# Altium schematic sheet pqm_v2_page3.SchDoc
size A4
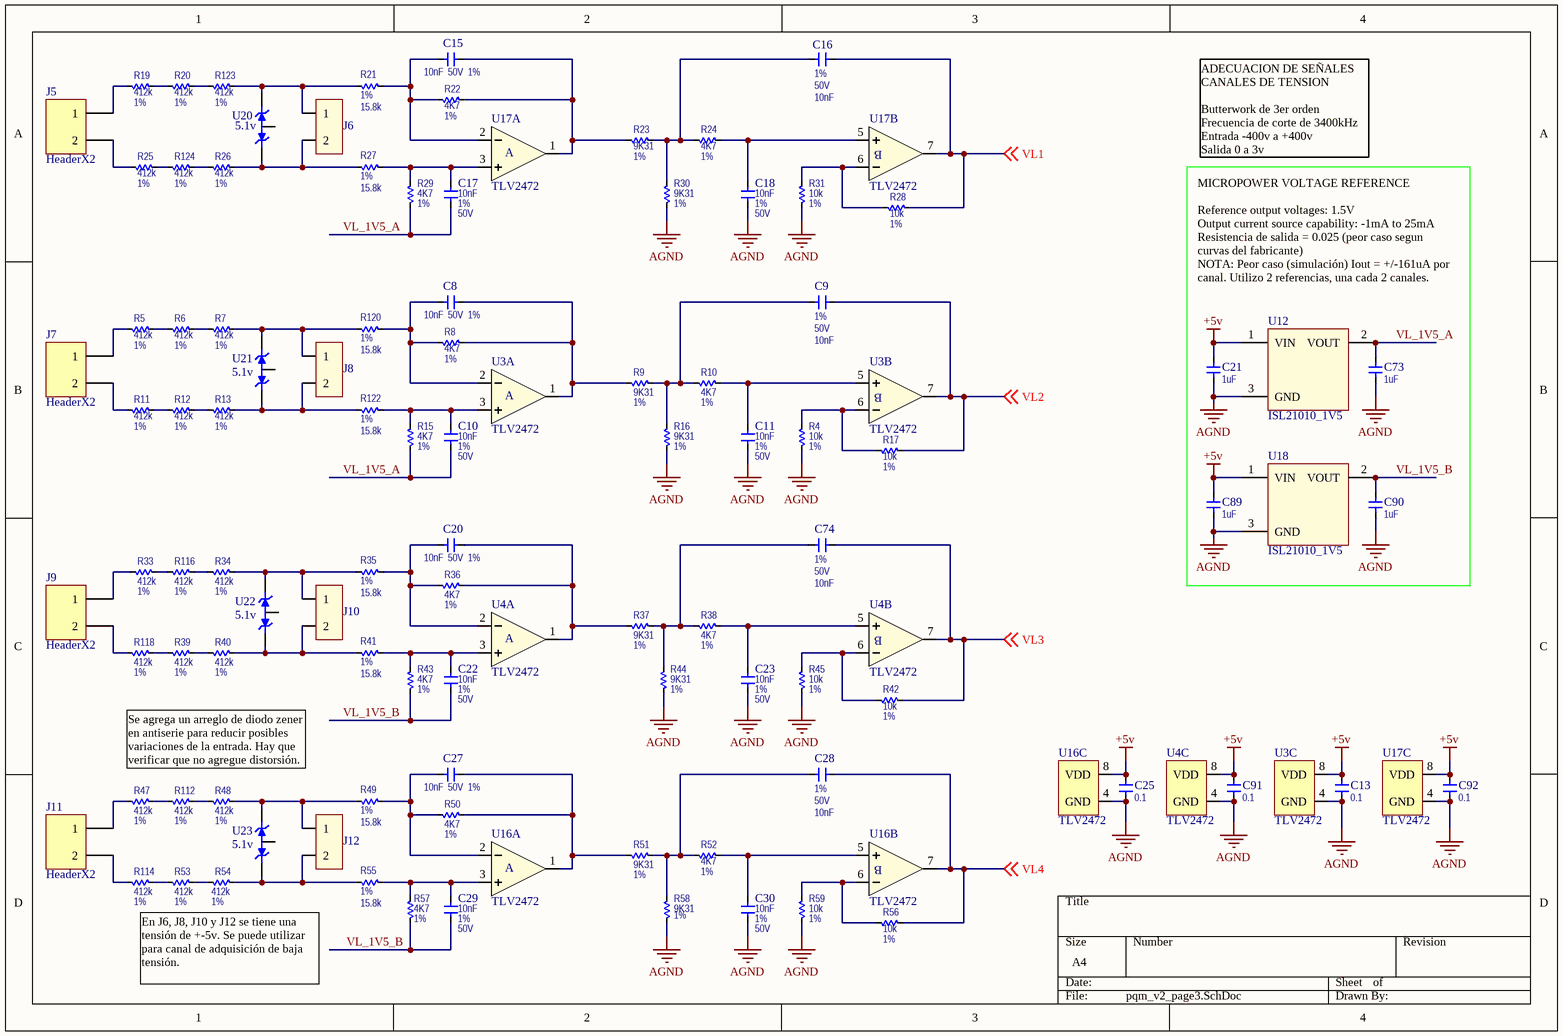
[diagram p0: pqm_v2_page3.SchDoc]

## Parts
C8  value 10nF  Tolerance: 1%  Voltage Rating: 50V  [CAPC2013X110N]  (hidden comment: CAP_GRM2195C1H103FA01D_MURATA)
C9  value 10nF  Tolerance: 1%  Voltage Rating: 50V  [CAPC2013X110N]  (hidden comment: CAP_GRM2195C1H103FA01D_MURATA)
C10  value 10nF  Tolerance: 1%  Voltage Rating: 50V  [CAPC2013X110N]  (hidden comment: CAP_GRM2195C1H103FA01D_MURATA)
C11  value 10nF  Tolerance: 1%  Voltage Rating: 50V  [CAPC2013X110N]  (hidden comment: CAP_GRM2195C1H103FA01D_MURATA)
C13  value 0.1  [CAPC2013X110N]  (hidden comment: CAP_CC0805KRX7R8BB104_YAGEO)
C15  value 10nF  Tolerance: 1%  Voltage Rating: 50V  [CAPC2013X110N]  (hidden comment: CAP_GRM2195C1H103FA01D_MURATA)
C16  value 10nF  Tolerance: 1%  Voltage Rating: 50V  [CAPC2013X110N]  (hidden comment: CAP_GRM2195C1H103FA01D_MURATA)
C17  value 10nF  Tolerance: 1%  Voltage Rating: 50V  [CAPC2013X110N]  (hidden comment: CAP_GRM2195C1H103FA01D_MURATA)
C18  value 10nF  Tolerance: 1%  Voltage Rating: 50V  [CAPC2013X110N]  (hidden comment: CAP_GRM2195C1H103FA01D_MURATA)
C20  value 10nF  Tolerance: 1%  Voltage Rating: 50V  [CAPC2013X110N]  (hidden comment: CAP_GRM2195C1H103FA01D_MURATA)
C21  value 1uF  [CAPC2013X110N]  (hidden comment: CAP_CC0805KKX7R7BB105_YAGEO)
C22  value 10nF  Tolerance: 1%  Voltage Rating: 50V  [CAPC2013X110N]  (hidden comment: CAP_GRM2195C1H103FA01D_MURATA)
C23  value 10nF  Tolerance: 1%  Voltage Rating: 50V  [CAPC2013X110N]  (hidden comment: CAP_GRM2195C1H103FA01D_MURATA)
C25  value 0.1  [CAPC2013X110N]  (hidden comment: CAP_CC0805KRX7R8BB104_YAGEO)
C27  value 10nF  Tolerance: 1%  Voltage Rating: 50V  [CAPC2013X110N]  (hidden comment: CAP_GRM2195C1H103FA01D_MURATA)
C28  value 10nF  Tolerance: 1%  Voltage Rating: 50V  [CAPC2013X110N]  (hidden comment: CAP_GRM2195C1H103FA01D_MURATA)
C29  value 10nF  Tolerance: 1%  Voltage Rating: 50V  [CAPC2013X110N]  (hidden comment: CAP_GRM2195C1H103FA01D_MURATA)
C30  value 10nF  Tolerance: 1%  Voltage Rating: 50V  [CAPC2013X110N]  (hidden comment: CAP_GRM2195C1H103FA01D_MURATA)
C73  value 1uF  [CAPC2013X110N]  (hidden comment: CAP_CC0805KKX7R7BB105_YAGEO)
C74  value 10nF  Tolerance: 1%  Voltage Rating: 50V  [CAPC2013X110N]  (hidden comment: CAP_GRM2195C1H103FA01D_MURATA)
C89  value 1uF  [CAPC2013X110N]  (hidden comment: CAP_CC0805KKX7R7BB105_YAGEO)
C90  value 1uF  [CAPC2013X110N]  (hidden comment: CAP_CC0805KKX7R7BB105_YAGEO)
C91  value 0.1  [CAPC2013X110N]  (hidden comment: CAP_CC0805KRX7R8BB104_YAGEO)
C92  value 0.1  [CAPC2013X110N]  (hidden comment: CAP_CC0805KRX7R8BB104_YAGEO)
J5  HeaderX2  [PHOENIX_1729128]
J6  CON_RADX2  [RAD2]  (value not drawn)
J7  HeaderX2  [PHOENIX_1729128]
J8  CON_RADX2  [RAD2]  (value not drawn)
J9  HeaderX2  [PHOENIX_1729128]
J10  CON_RADX2  [RAD2]  (value not drawn)
J11  HeaderX2  [PHOENIX_1729128]
J12  CON_RADX2  [RAD2]  (value not drawn)
R4  value 10k  Tolerance: 1%  [RESC2013X065BN]  (hidden comment: RES_RC0805FR-0710KL_YAGEO)
R5  value 412k  Tolerance: 1%  [RESC2013X065BN]  (hidden comment: RES_RC0805FR-07412KL_YAGEO)
R6  value 412k  Tolerance: 1%  [RESC2013X065BN]  (hidden comment: RES_RC0805FR-07412KL_YAGEO)
R7  value 412k  Tolerance: 1%  [RESC2013X065BN]  (hidden comment: RES_RC0805FR-07412KL_YAGEO)
R8  value 4K7  Tolerance: 1%  [RESC2013X065BN]  (hidden comment: RES_RC0805FR-074K7L_YAGEO)
R9  value 9K31  Tolerance: 1%  [RESC2013X065BN]  (hidden comment: RES_RC0805FR-079K31L_YAGEO)
R10  value 4K7  Tolerance: 1%  [RESC2013X065BN]  (hidden comment: RES_RC0805FR-074K7L_YAGEO)
R11  value 412k  Tolerance: 1%  [RESC2013X065BN]  (hidden comment: RES_RC0805FR-07412KL_YAGEO)
R12  value 412k  Tolerance: 1%  [RESC2013X065BN]  (hidden comment: RES_RC0805FR-07412KL_YAGEO)
R13  value 412k  Tolerance: 1%  [RESC2013X065BN]  (hidden comment: RES_RC0805FR-07412KL_YAGEO)
R15  value 4K7  Tolerance: 1%  [RESC2013X065BN]  (hidden comment: RES_RC0805FR-074K7L_YAGEO)
R16  value 9K31  Tolerance: 1%  [RESC2013X065BN]  (hidden comment: RES_RC0805FR-079K31L_YAGEO)
R17  value 10k  Tolerance: 1%  [RESC2013X065BN]  (hidden comment: RES_RC0805FR-0710KL_YAGEO)
R19  value 412k  Tolerance: 1%  [RESC2013X065BN]  (hidden comment: RES_RC0805FR-07412KL_YAGEO)
R20  value 412k  Tolerance: 1%  [RESC2013X065BN]  (hidden comment: RES_RC0805FR-07412KL_YAGEO)
R21  value 15.8k  Tolerance: 1%  [RESC2013X065BN]  (hidden comment: RES_RC0805FR-0715K8L_YAGEO)
R22  value 4K7  Tolerance: 1%  [RESC2013X065BN]  (hidden comment: RES_RC0805FR-074K7L_YAGEO)
R23  value 9K31  Tolerance: 1%  [RESC2013X065BN]  (hidden comment: RES_RC0805FR-079K31L_YAGEO)
R24  value 4K7  Tolerance: 1%  [RESC2013X065BN]  (hidden comment: RES_RC0805FR-074K7L_YAGEO)
R25  value 412k  Tolerance: 1%  [RESC2013X065BN]  (hidden comment: RES_RC0805FR-07412KL_YAGEO)
R26  value 412k  Tolerance: 1%  [RESC2013X065BN]  (hidden comment: RES_RC0805FR-07412KL_YAGEO)
R27  value 15.8k  Tolerance: 1%  [RESC2013X065BN]  (hidden comment: RES_RC0805FR-0715K8L_YAGEO)
R28  value 10k  Tolerance: 1%  [RESC2013X065BN]  (hidden comment: RES_RC0805FR-0710KL_YAGEO)
R29  value 4K7  Tolerance: 1%  [RESC2013X065BN]  (hidden comment: RES_RC0805FR-074K7L_YAGEO)
R30  value 9K31  Tolerance: 1%  [RESC2013X065BN]  (hidden comment: RES_RC0805FR-079K31L_YAGEO)
R31  value 10k  Tolerance: 1%  [RESC2013X065BN]  (hidden comment: RES_RC0805FR-0710KL_YAGEO)
R33  value 412k  Tolerance: 1%  [RESC2013X065BN]  (hidden comment: RES_RC0805FR-07412KL_YAGEO)
R34  value 412k  Tolerance: 1%  [RESC2013X065BN]  (hidden comment: RES_RC0805FR-07412KL_YAGEO)
R35  value 15.8k  Tolerance: 1%  [RESC2013X065BN]  (hidden comment: RES_RC0805FR-0715K8L_YAGEO)
R36  value 4K7  Tolerance: 1%  [RESC2013X065BN]  (hidden comment: RES_RC0805FR-074K7L_YAGEO)
R37  value 9K31  Tolerance: 1%  [RESC2013X065BN]  (hidden comment: RES_RC0805FR-079K31L_YAGEO)
R38  value 4K7  Tolerance: 1%  [RESC2013X065BN]  (hidden comment: RES_RC0805FR-074K7L_YAGEO)
R39  value 412k  Tolerance: 1%  [RESC2013X065BN]  (hidden comment: RES_RC0805FR-07412KL_YAGEO)
R40  value 412k  Tolerance: 1%  [RESC2013X065BN]  (hidden comment: RES_RC0805FR-07412KL_YAGEO)
R41  value 15.8k  Tolerance: 1%  [RESC2013X065BN]  (hidden comment: RES_RC0805FR-0715K8L_YAGEO)
R42  value 10k  Tolerance: 1%  [RESC2013X065BN]  (hidden comment: RES_RC0805FR-0710KL_YAGEO)
R43  value 4K7  Tolerance: 1%  [RESC2013X065BN]  (hidden comment: RES_RC0805FR-074K7L_YAGEO)
R44  value 9K31  Tolerance: 1%  [RESC2013X065BN]  (hidden comment: RES_RC0805FR-079K31L_YAGEO)
R45  value 10k  Tolerance: 1%  [RESC2013X065BN]  (hidden comment: RES_RC0805FR-0710KL_YAGEO)
R47  value 412k  Tolerance: 1%  [RESC2013X065BN]  (hidden comment: RES_RC0805FR-07412KL_YAGEO)
R48  value 412k  Tolerance: 1%  [RESC2013X065BN]  (hidden comment: RES_RC0805FR-07412KL_YAGEO)
R49  value 15.8k  Tolerance: 1%  [RESC2013X065BN]  (hidden comment: RES_RC0805FR-0715K8L_YAGEO)
R50  value 4K7  Tolerance: 1%  [RESC2013X065BN]  (hidden comment: RES_RC0805FR-074K7L_YAGEO)
R51  value 9K31  Tolerance: 1%  [RESC2013X065BN]  (hidden comment: RES_RC0805FR-079K31L_YAGEO)
R52  value 4K7  Tolerance: 1%  [RESC2013X065BN]  (hidden comment: RES_RC0805FR-074K7L_YAGEO)
R53  value 412k  Tolerance: 1%  [RESC2013X065BN]  (hidden comment: RES_RC0805FR-07412KL_YAGEO)
R54  value 412k  Tolerance: 1%  [RESC2013X065BN]  (hidden comment: RES_RC0805FR-07412KL_YAGEO)
R55  value 15.8k  Tolerance: 1%  [RESC2013X065BN]  (hidden comment: RES_RC0805FR-0715K8L_YAGEO)
R56  value 10k  Tolerance: 1%  [RESC2013X065BN]  (hidden comment: RES_RC0805FR-0710KL_YAGEO)
R57  value 4K7  Tolerance: 1%  [RESC2013X065BN]  (hidden comment: RES_RC0805FR-074K7L_YAGEO)
R58  value 9K31  Tolerance: 1%  [RESC2013X065BN]  (hidden comment: RES_RC0805FR-079K31L_YAGEO)
R59  value 10k  Tolerance: 1%  [RESC2013X065BN]  (hidden comment: RES_RC0805FR-0710KL_YAGEO)
R112  value 412k  Tolerance: 1%  [RESC2013X065BN]  (hidden comment: RES_RC0805FR-07412KL_YAGEO)
R114  value 412k  Tolerance: 1%  [RESC2013X065BN]  (hidden comment: RES_RC0805FR-07412KL_YAGEO)
R116  value 412k  Tolerance: 1%  [RESC2013X065BN]  (hidden comment: RES_RC0805FR-07412KL_YAGEO)
R118  value 412k  Tolerance: 1%  [RESC2013X065BN]  (hidden comment: RES_RC0805FR-07412KL_YAGEO)
R120  value 15.8k  Tolerance: 1%  [RESC2013X065BN]  (hidden comment: RES_RC0805FR-0715K8L_YAGEO)
R122  value 15.8k  Tolerance: 1%  [RESC2013X065BN]  (hidden comment: RES_RC0805FR-0715K8L_YAGEO)
R123  value 412k  Tolerance: 1%  [RESC2013X065BN]  (hidden comment: RES_RC0805FR-07412KL_YAGEO)
R124  value 412k  Tolerance: 1%  [RESC2013X065BN]  (hidden comment: RES_RC0805FR-07412KL_YAGEO)
U3  value TLV2472  [SOIC127P600-8BN]  (hidden comment: IC_TLV2472_ANALOG)  (parts A,B,C of 3)
U4  value TLV2472  [SOIC127P600-8BN]  (hidden comment: IC_TLV2472_ANALOG)  (parts A,B,C of 3)
U12  ISL21010_1V5  [SOT23-3M]
U16  value TLV2472  [SOIC127P600-8BN]  (hidden comment: IC_TLV2472_ANALOG)  (parts A,B,C of 3)
U17  value TLV2472  [SOIC127P600-8BN]  (hidden comment: IC_TLV2472_ANALOG)  (parts A,B,C of 3)
U18  ISL21010_1V5  [SOT23-3M]
U20  Voltage: 5.1v  [SOT23-3M]  (hidden comment: IC_IAZ23C5V6-E3-18_VISHAY)
U21  Voltage: 5.1v  [SOT23-3M]  (hidden comment: IC_IAZ23C5V6-E3-18_VISHAY)
U22  Voltage: 5.1v  [SOT23-3M]  (hidden comment: IC_IAZ23C5V6-E3-18_VISHAY)
U23  Voltage: 5.1v  [SOT23-3M]  (hidden comment: IC_IAZ23C5V6-E3-18_VISHAY)

## Nets
+5v: C13.1(T1) C21.1(T1) C25.1(T1) C89.1(T1) C91.1(T1) C92.1(T1) U3.8(VDD) U4.8(VDD) U12.1(VIN) U16.8(VDD) U17.8(VDD) U18.1(VIN)
AGND: C11.1(T1) C13.2(T2) C18.1(T1) C21.2(T2) C23.1(T1) C25.2(T2) C30.1(T1) C73.2(T2) C89.2(T2) C90.2(T2) C91.2(T2) C92.2(T2) R4.2(T2) R16.1(T1) R30.2(T2) R31.2(T2) R44.2(T2) R45.2(T2) R58.1(T1) R59.2(T2) U3.4(GND) U4.4(GND) U12.3(GND) U16.4(GND) U17.4(GND) U18.3(GND)
VL1: C16.2(T2) R28.1(T1) U17.7(OUTB) ; off-sheet VL1
VL2: C9.2(T2) R17.1(T1) U3.7(OUTB) ; off-sheet VL2
VL3: C74.2(T2) R42.1(T1) U4.7(OUTB) ; off-sheet VL3
VL4: C28.2(T2) R56.1(T1) U16.7(OUTB) ; off-sheet VL4
VL_1V5_A: C10.1(T1) C17.1(T1) C73.1(T1) R15.2(T2) R29.2(T2) U12.2(VOUT)
VL_1V5_B: C22.1(T1) C29.1(T1) C90.1(T1) R43.2(T2) R57.2(T2) U18.2(VOUT)
NetC8_1: C8.1(T1) R8.2(T2) R120.1(T1) U3.2(INA-)
NetC8_2: C8.2(T2) R8.1(T1) R9.2(T2) U3.1(OUTA)
NetC9_1: C9.1(T1) R9.1(T1) R10.2(T2) R16.2(T2)
NetC10_2: C10.2(T2) R15.1(T1) R122.1(T1) U3.3(INA+)
NetC11_2: C11.2(T2) R10.1(T1) U3.5(INB+)
NetC15_1: C15.1(T1) R21.1(T1) R22.2(T2) U17.2(INA-)
NetC15_2: C15.2(T2) R22.1(T1) R23.2(T2) U17.1(OUTA)
NetC16_1: C16.1(T1) R23.1(T1) R24.2(T2) R30.1(T1)
NetC17_2: C17.2(T2) R27.1(T1) R29.1(T1) U17.3(INA+)
NetC18_2: C18.2(T2) R24.1(T1) U17.5(INB+)
NetC20_1: C20.1(T1) R35.1(T1) R36.2(T2) U4.2(INA-)
NetC20_2: C20.2(T2) R36.1(T1) R37.2(T2) U4.1(OUTA)
NetC22_2: C22.2(T2) R41.1(T1) R43.1(T1) U4.3(INA+)
NetC23_2: C23.2(T2) R38.1(T1) U4.5(INB+)
NetC27_1: C27.1(T1) R49.1(T1) R50.2(T2) U16.2(INA-)
NetC27_2: C27.2(T2) R50.1(T1) R51.1(T1) U16.1(OUTA)
NetC28_1: C28.1(T1) R51.2(T2) R52.2(T2) R58.2(T2)
NetC29_2: C29.2(T2) R55.1(T1) R57.1(T1) U16.3(INA+)
NetC30_2: C30.2(T2) R52.1(T1) U16.5(INB+)
NetC74_1: C74.1(T1) R37.1(T1) R38.2(T2) R44.1(T1)
NetJ5_1: J5.1 R19.2(T2)
NetJ5_2: J5.2 R25.2(T2)
NetJ6_1: J6.1 R21.2(T2) R123.1(T1) U20.1
NetJ6_2: J6.2 R26.1(T1) R27.2(T2) U20.2
NetJ7_1: J7.1 R5.2(T2)
NetJ7_2: J7.2 R11.2(T2)
NetJ8_1: J8.1 R7.1(T1) R120.2(T2) U21.1
NetJ8_2: J8.2 R13.1(T1) R122.2(T2) U21.2
NetJ9_1: J9.1 R33.2(T2)
NetJ9_2: J9.2 R118.2(T2)
NetJ10_1: J10.1 R34.1(T1) R35.2(T2) U22.1
NetJ10_2: J10.2 R40.1(T1) R41.2(T2) U22.2
NetJ11_1: J11.1 R47.2(T2)
NetJ11_2: J11.2 R114.2(T2)
NetJ12_1: J12.1 R48.1(T1) R49.2(T2) U23.1
NetJ12_2: J12.2 R54.1(T1) R55.2(T2) U23.2
NetR4_1: R4.1(T1) R17.2(T2) U3.6(INB-)
NetR5_1: R5.1(T1) R6.2(T2)
NetR6_1: R6.1(T1) R7.2(T2)
NetR11_1: R11.1(T1) R12.2(T2)
NetR12_1: R12.1(T1) R13.2(T2)
NetR19_1: R19.1(T1) R20.2(T2)
NetR20_1: R20.1(T1) R123.2(T2)
NetR25_1: R25.1(T1) R124.2(T2)
NetR26_2: R26.2(T2) R124.1(T1)
NetR28_2: R28.2(T2) R31.1(T1) U17.6(INB-)
NetR33_1: R33.1(T1) R116.2(T2)
NetR34_2: R34.2(T2) R116.1(T1)
NetR39_1: R39.1(T1) R40.2(T2)
NetR39_2: R39.2(T2) R118.1(T1)
NetR42_2: R42.2(T2) R45.1(T1) U4.6(INB-)
NetR47_1: R47.1(T1) R112.2(T2)
NetR48_2: R48.2(T2) R112.1(T1)
NetR53_1: R53.1(T1) R54.2(T2)
NetR53_2: R53.2(T2) R114.1(T1)
NetR56_2: R56.2(T2) R59.1(T1) U16.6(INB-)

Not connected (* = marked no-connect by the designer): U20 3; U21 3; U22 3; U23 3

## Notes on the sheet
- ADECUACION DE SEÑALES
  CANALES DE TENSION
  Butterwork de 3er orden
  Frecuencia de corte de 3400kHz
  Entrada -400v a +400v
  Salida 0 a 3v
- MICROPOWER VOLTAGE REFERENCE
  Reference output voltages: 1.5V
  Output current source capability: -1mA to 25mA
  Resistencia de salida = 0.025 (peor caso segun curvas del fabricante)
  NOTA: Peor caso (simulación) Iout = +/-161uA por canal. Utilizo 2 referencias, una cada 2 canales.
- Se agrega un arreglo de diodo zener en antiserie para reducir posibles variaciones de la entrada. Hay que verificar que no agregue distorsión.
- En J6, J8, J10 y J12 se tiene una tensión de +-5v. Se puede utilizar para canal de adquisición de baja tensión.
- (in symbol IC_TLV2472_ANALOG, part A) A
- (in symbol IC_TLV2472_ANALOG, part B) B

## Library data of the parts
C8-C11 C15-C18 C20 C22 C23 C27-C30 C74 = CAP_GRM2195C1H103FA01D_MURATA: CAP CER 10000PF 50V NP0 0805; Manufacturer: Murata Electronics North America; Supplier: *; Power Rating: *; BOM Populate: *; Digikey Part Number: 490-8295-1-ND; Mouser Part Number: 81-GRM2195C1H103FA1D; Manufacturer Part Number: GRM2195C1H103FA01D
C13 C25 C91 C92 = CAP_CC0805KRX7R8BB104_YAGEO: CAP CER 0.1UF 25V 10% X7R 0805; Manufacturer: Yageo; Supplier: *; Tolerance: 10%; Power Rating: *; Voltage Rating: 25V; BOM Populate: *; Digikey Part Number: 311-1141-1-ND; Mouser Part Number: 603-CC805KRX7R8BB104; Manufacturer Part Number: CC0805KRX7R8BB104
C21 C73 C89 C90 = CAP_CC0805KKX7R7BB105_YAGEO: CAP CER 1UF 16V X7R 0805; Manufacturer: YAGEO; Tolerance: 10%; Supplier: *; Supplier Part No: *; Power Rating: *; BOM Populate: *; Voltage Rating: 16V; Digikey Part Number: 311-1365-1-ND; Mouser Part Number: 603-CC805KKX7R7BB105; Manufacturer Part Number: CC0805KKX7R7BB105
J5 J7 J9 J11 = CON_HeaderX2
R4 R17 R28 R31 R42 R45 R56 R59 = RES_RC0805FR-0710KL_YAGEO: RES SMD 10K OHM 1% 1/8W 0805; Manufacturer: Yageo; BOM Populate: *; Supplier Part No: *; Supplier: *; Digikey Part Number: 311-10.0KCRCT-ND; Power Rating: 1/8W; Manufacturer Part Number: RC0805FR-0710KL; Mouser Part Number: 603-RC0805FR-0710KL
R5-R7 R11-R13 R19 R20 R25 R26 R33 R34 R39 R40 R47 R48 R53 R54 R112 R114 R116 R118 R123 R124 = RES_RC0805FR-07412KL_YAGEO: RES SMD 412K OHM 1% 1/8W 0805; Manufacturer: Yageo; BOM Populate: *; Supplier Part No: *; Supplier: *; Digikey Part Number: 311-412KCRCT-ND; Power Rating: 1/8W; Manufacturer Part Number: RC0805FR-07412KL; Mouser Part Number: 603-RC0805FR-07412KL
R8 R10 R15 R22 R24 R29 R36 R38 R43 R50 R52 R57 = RES_RC0805FR-074K7L_YAGEO: RES SMD 4.7K OHM 1% 1/8W 0805; Manufacturer: Yageo; BOM Populate: *; Supplier Part No: *; Supplier: *; Digikey Part Number: 311-4.70KCRCT-ND; Power Rating: 1/8W; Manufacturer Part Number: RC0805FR-074K7L; Mouser Part Number: 603-RC0805FR-074K7L
R9 R16 R23 R30 R37 R44 R51 R58 = RES_RC0805FR-079K31L_YAGEO: RES SMD 9.31K OHM 1% 1/8W 0805; Manufacturer: Yageo; BOM Populate: *; Supplier Part No: *; Supplier: *; Digikey Part Number: 311-9.31KCRCT-ND; Power Rating: 1/8W; Manufacturer Part Number: RC0805FR-079K31L; Mouser Part Number: 603-RC0805FR-079K31L
R21 R27 R35 R41 R49 R55 R120 R122 = RES_RC0805FR-0715K8L_YAGEO: RES SMD 15.8K OHM 1% 1/8W 0805; Manufacturer: Yageo; BOM Populate: *; Supplier Part No: *; Supplier: *; Digikey Part Number: 311-15.8KCRCT-ND; Power Rating: 1/8W; Manufacturer Part Number: RC0805FR-0715K8L; Mouser Part Number: 603-RC0805FR-0715K8L
U3 U4 U16 U17 = IC_TLV2472_ANALOG: IC OPAMP GP 2.8MHZ RRO 8SOIC; Manufacturer: Texas Instrument; Manufacturer Part Number: TLV2472CDR; Digikey Part Number: 296-2440-1-ND; Mouser Part Number: 595-TLV2472CDR
U12 U18 = IC_ISL21010_1V5_INTERSIL: IC VREF SERIES 1.5V SOT23-3; Manufacturer Part Number: ISL21010CFH315Z-TK; Digikey Part Number: ISL21010CFH315Z-TKCT-ND; Mouser Part Number: 968-ISL21010CFH315ZT
U20-U23 = IC_IAZ23C5V6-E3-18_VISHAY: DIODE ZENER ARRAY 5.6V SOT23; Digikey Part Number: AZ23C5V6-E3-18CT-ND; Manufacturer Part Number: AZ23C5V6-E3-18; Mouser Part Number: 78-AZ23C5V6-E3-18